# EAGLE design avrdmxsmt (EAGLE 6.5.0)
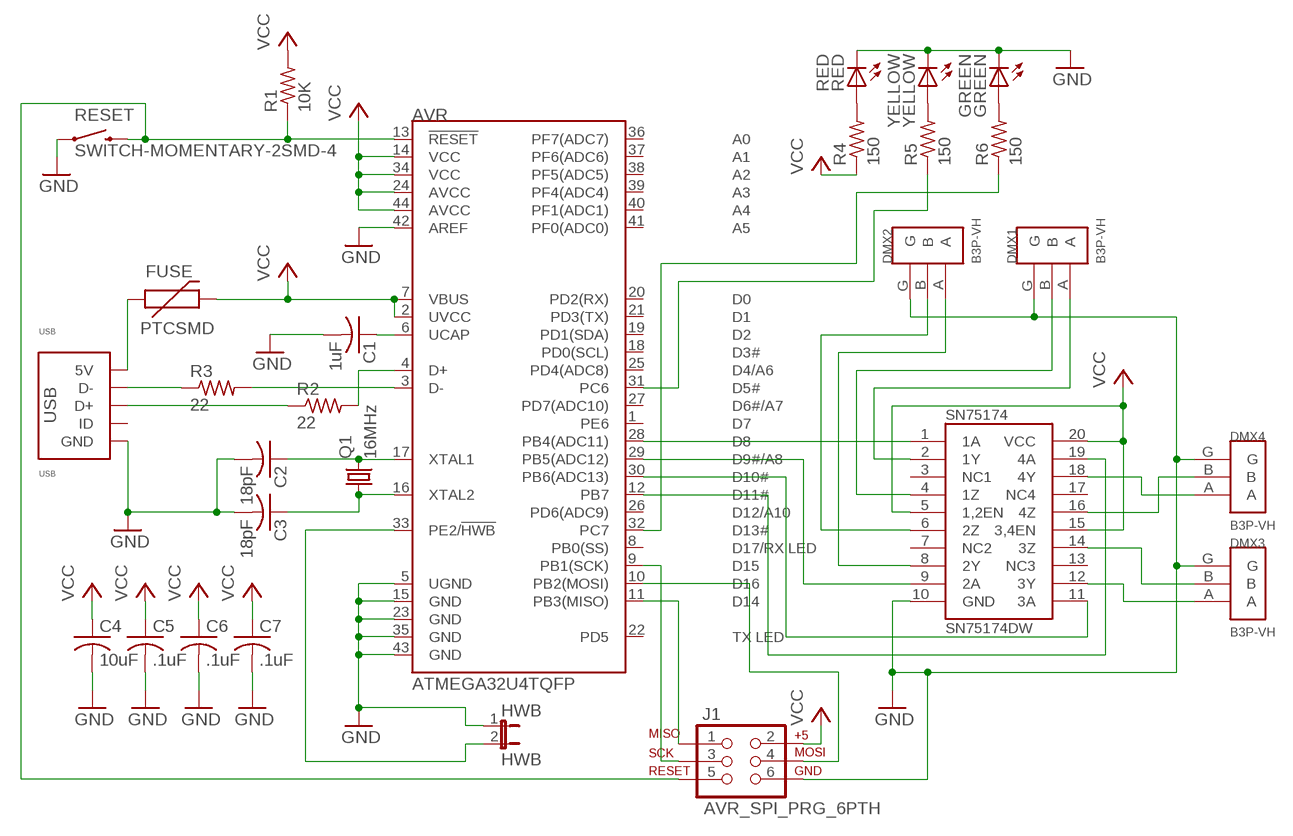
[diagram p0: schematic, sheet 1]

## Parts
AVR  ATMEGA32U4TQFP  [SPARKFUN-DIGITALIC_TQFP44]
C1  1uF  C-USC0603K  [C0603K]
C2  18pF  C-USC0603K  [C0603K]
C3  18pF  C-USC0603K  [C0603K]
C4  10uF  C-USC0603K  [C0603K]
C5  .1uF  C-USC0603K  [C0603K]
C6  .1uF  C-USC0603K  [C0603K]
C7  .1uF  C-USC0603K  [C0603K]
DMX1  B3P-VH  [B3P-VH]
DMX2  B3P-VH  [B3P-VH]
DMX3  B3P-VH  [B3P-VH]
DMX4  B3P-VH  [B3P-VH]
FUSE  PTCSMD  [PTC-1206]
GREEN  GREEN  LED-GREEN0603  [LED-0603]
HWB  HWB  JUMPER-2PTH  [1X02]
J1  AVR_SPI_PRG_6PTH  [2X3]
Q1  16MHz  CRYSTALSM49  [SM49]
R1  10K  R-US_R0603  [R0603]
R2  22  R-US_R0603  [R0603]
R3  22  R-US_R0603  [R0603]
R4  150  R-US_R0603  [R0603]
R5  150  R-US_R0603  [R0603]
R6  150  R-US_R0603  [R0603]
RED  RED  LED-RED0603  [LED-0603]
RESET  SWITCH-MOMENTARY-2SMD-4  [TACTILE_SWITCH_TALL]
SN75174  SN75174DW  [SOIC20R]
USB  USB  USB10118193-0001LF  [10118193-0001LF]
YELLOW  YELLOW  LED-YELLOW0603  [LED-0603]

## Nets
GND: AVR.5(UGND) AVR.15(GND) AVR.23(GND) AVR.35(GND) AVR.42(AREF) AVR.43(GND) C1.2 C2.2 C3.2 C4.2 C5.2 C6.2 C7.2 DMX1.G DMX2.G DMX3.G DMX4.G GREEN.C HWB.1 J1.6 RED.C RESET.A2 SN75174.10(GND) USB.5(GND) USB.S1(GND) USB.S2(GND) USB.S3(GND) USB.S4(GND) YELLOW.C
N$1: AVR.13(!RESET) J1.5 R1.1 RESET.B2
N$2: AVR.3(D-) R3.2
N$3: R3.1 USB.2(D-)
N$4: AVR.4(D+) R2.2
N$5: R2.1 USB.3(D+)
N$6: FUSE.1 USB.1(5V)
N$7: AVR.6(UCAP) C1.1
N$8: AVR.17(XTAL1) C2.1 Q1.2
N$9: AVR.16(XTAL2) C3.1 Q1.1
N$10: AVR.28(PB4(ADC11)) SN75174.1(1A)
N$11: AVR.29(PB5(ADC12)) SN75174.9(2A)
N$12: AVR.30(PB6(ADC13)) SN75174.11(3A)
N$13: AVR.12(PB7) SN75174.19(4A)
N$14: DMX1.A SN75174.2(1Y)
N$15: DMX1.B SN75174.4(1Z)
N$16: DMX2.A SN75174.8(2Y)
N$17: DMX2.B SN75174.6(2Z)
N$18: DMX3.A SN75174.12(3Y)
N$19: DMX3.B SN75174.14(3Z)
N$20: DMX4.A SN75174.18(4Y)
N$21: DMX4.B SN75174.16(4Z)
N$22: R4.2 RED.A
N$23: R5.2 YELLOW.A
N$24: GREEN.A R6.2
N$25: AVR.33(PE2/!HWB) HWB.2
N$26: AVR.32(PC7) R6.1
N$27: AVR.31(PC6) R5.1
N$29: AVR.10(PB2(MOSI)) J1.4
N$30: AVR.11(PB3(MISO)) J1.1
N$31: AVR.9(PB1(SCK)) J1.3
VCC: AVR.2(UVCC) AVR.7(VBUS) AVR.14(VCC) AVR.24(AVCC) AVR.34(VCC) AVR.44(AVCC) C4.1 C5.1 C6.1 C7.1 FUSE.2 J1.2 R1.2 R4.1 SN75174.5(1,2EN) SN75174.15(3,4EN) SN75174.20(VCC)
Unconnected: AVR.1(PE6) AVR.8(PB0(SS)) AVR.18(PD0(SCL)) AVR.19(PD1(SDA)) AVR.20(PD2(RX)) AVR.21(PD3(TX)) AVR.22(PD5) AVR.25(PD4(ADC8)) AVR.26(PD6(ADC9)) AVR.27(PD7(ADC10)) AVR.36(PF7(ADC7)) AVR.37(PF6(ADC6)) AVR.38(PF5(ADC5)) AVR.39(PF4(ADC4)) AVR.40(PF1(ADC1)) AVR.41(PF0(ADC0)) SN75174.3(NC1) SN75174.7(NC2) SN75174.13(NC3) SN75174.17(NC4) USB.4(ID)

## Library data of the parts
AVR = SparkFun-DigitalIC:ATMEGA32U4: Atmel 44-pin 8-bit Microcontroller with 32KBytes of ISP Flash and USB Controller ----- Please use the QFN-44-NOPAD_1:1 package for the footprint of all boards using a 32U4. Route traces directly away from the pads as much as possible.; PROD_ID: IC-11161
C1-C7 = rcl:C-US: CAPACITOR, American symbol
DMX1-DMX4 = avrdmxsmt:B3P-VH
FUSE = SparkFun-PowerIC:PTC: Resettable Fuse PTC Resettable Fuse. Spark Fun Electronics SKU : COM-08357; PROD_ID: RES-11150
GREEN = SparkFun-LED:LED-GREEN: Various green LEDs Green LEDs used in SFE Production 0603- DIO-00821 LARGE- DIO-00862 LILYPAD- DIO-09910; PROD_ID: DIO-00821
HWB = SparkFun-Passives:JUMPER-2: Jumper Basic 0.1" spaced jumper. Use with breakaway headers.
J1 = SparkFun-Connectors:AVR_SPI_PRG_6: AVR ISP 6 Pin This is the reduced ISP connector for AVR programming. Common on Arduino. This footprint will take up less PCB space and can be used with a 10-pin to 6-pin adapter such as SKU: BOB-08508
Q1 = crystal:CRYSTAL: CRYSTAL; OC_FARNELL: unknown; OC_NEWARK: unknown
R1-R6 = rcl:R-US_: RESISTOR, American symbol
RED = SparkFun-LED:LED-RED: Assorted Red LEDs LilyPad 1206- DIO-09912 1206- DIO-00809 0603- DIO-00819; PROD_ID: DIO-00819
RESET = SparkFun-Electromechanical:SWITCH-MOMENTARY-2: Various NO switches- pushbuttons, reed, etc; PROD_ID: SWCH-11966
SN75174 = avrdmxsmt:SN75174DW
USB = PP_Connectors:USB
YELLOW = SparkFun-LED:LED-YELLOW: Yellow SMD LEDs LilyPad 1206- DIO-09909 0603- DIO-09003; PROD_ID: DIO-09003

## Board
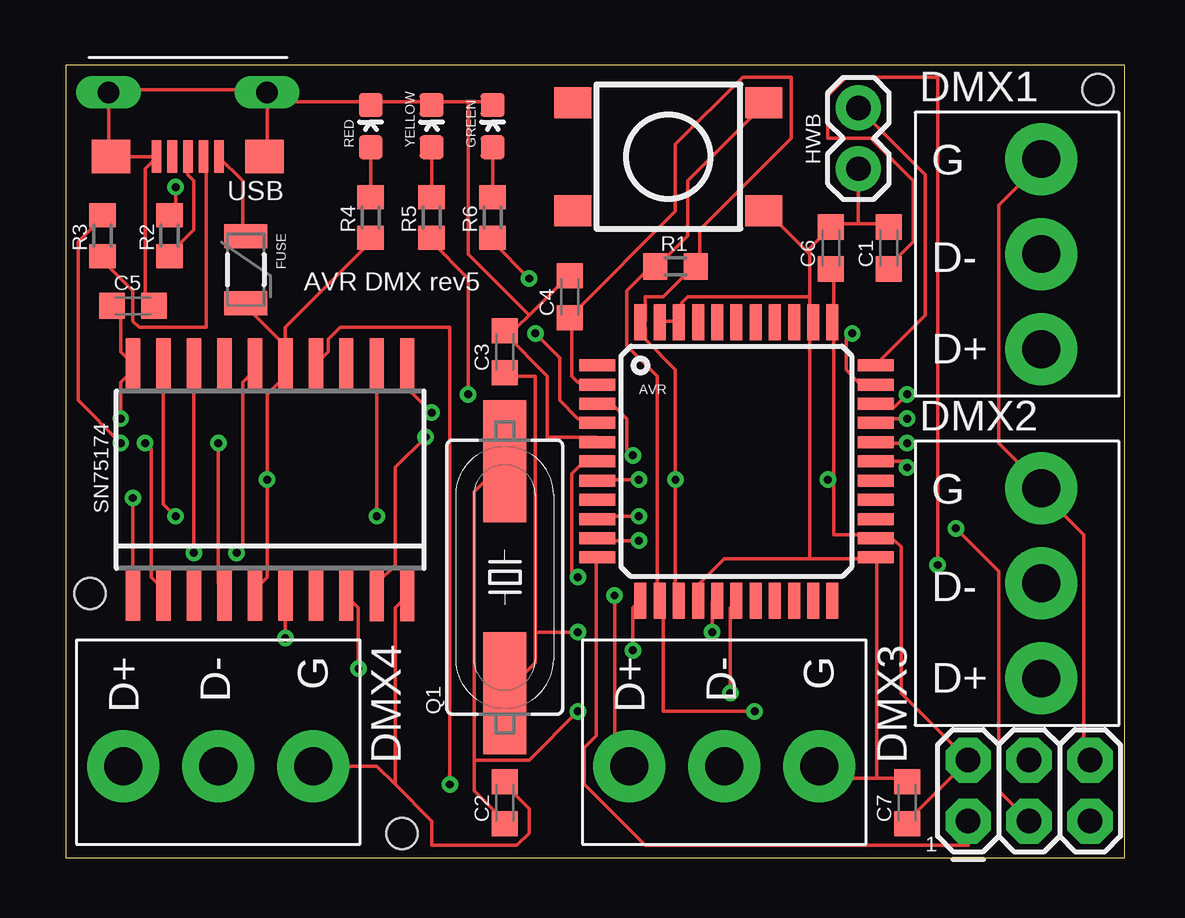
[diagram p1: board, top side]
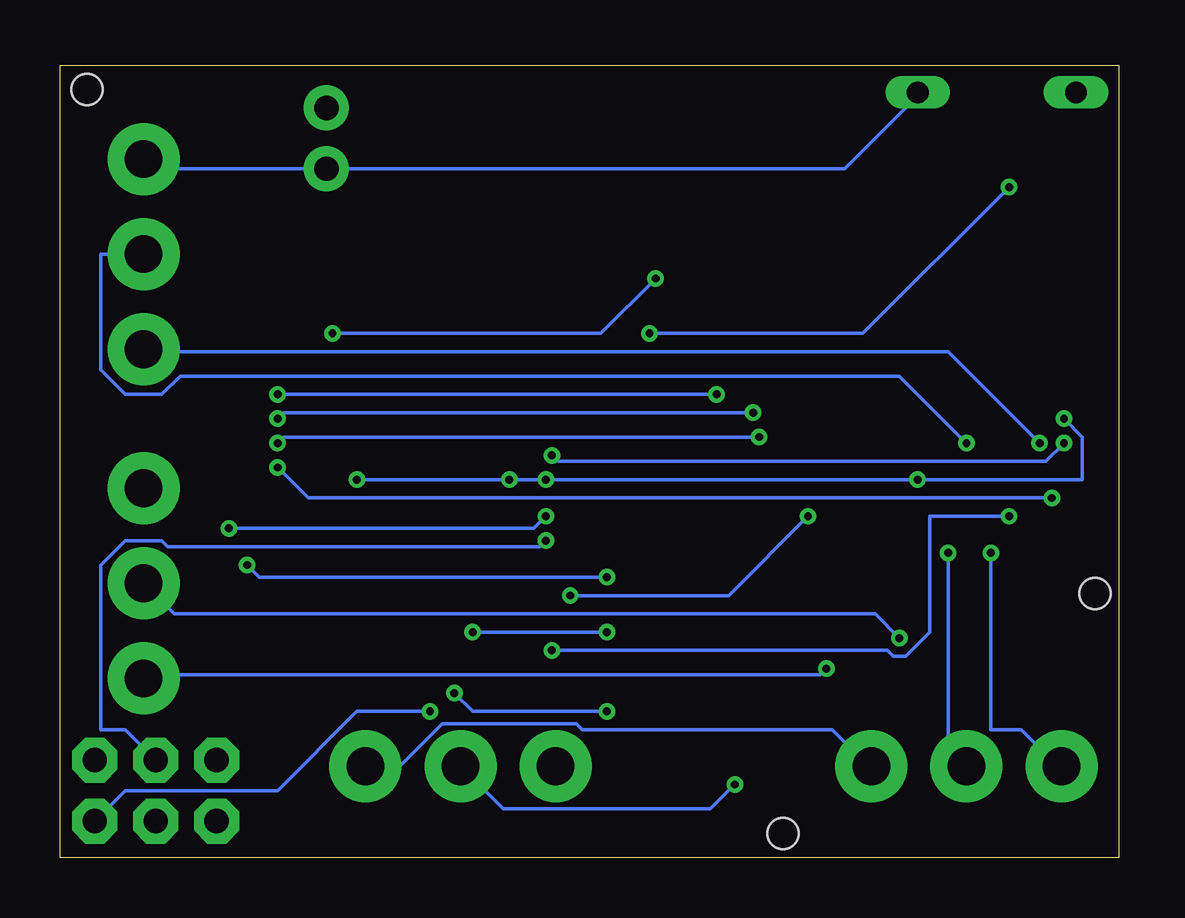
[diagram p2: board, bottom side, seen from below]

Size 44.12 x 33.01 mm. Coordinates in mm from the lower left corner, seen from the top.
Outline: 0,0 44.12,0 44.12,33.01 0,33.01 0,0
Copper layers (1*16): Top 0.0356mm / dielectric 1.5011mm / Bottom 0.0356mm
Design rules "LaenPCBOrder": minimum track width 6mil, minimum drill 13mil, track to track 6mil, track to pad 6mil, pad to pad 6mil, via to via 6mil, smd to smd 6mil, copper to edge 15mil, drill to drill 6mil, minimum pad ring 7mil, minimum via ring 7mil, stop-mask expansion 3mil, vias tented up to drill 0mil, thermal gap 10mil
Holes 1.3 mm at 43,32 1,11 14,1

### Footprints (pad centres in the part's own frame; a part is rotated, then mirrored left to right if it is on the bottom)
SPARKFUN-DIGITALIC_TQFP44 = smd 1.5 x 0.5: 1 -5.8,4; 2 -5.8,3.2; 3 -5.8,2.4; 4 -5.8,1.6; 5 -5.8,0.8; 6 -5.8,0; 7 -5.8,-0.8; 8 -5.8,-1.6; 9 -5.8,-2.4; 10 -5.8,-3.2; 11 -5.8,-4; 23 5.8,-4; 24 5.8,-3.2; 25 5.8,-2.4; 26 5.8,-1.6; 27 5.8,-0.8; 28 5.8,0; 29 5.8,0.8; 30 5.8,1.6; 31 5.8,2.4; 32 5.8,3.2; 33 5.8,4 | smd 0.5 x 1.5: 12 -4,-5.8; 13 -3.2,-5.8; 14 -2.4,-5.8; 15 -1.6,-5.8; 16 -0.8,-5.8; 17 0,-5.8; 18 0.8,-5.8; 19 1.6,-5.8; 20 2.4,-5.8; 21 3.2,-5.8; 22 4,-5.8; 34 4,5.8; 35 3.2,5.8; 36 2.4,5.8; 37 1.6,5.8; 38 0.8,5.8; 39 0,5.8; 40 -0.8,5.8; 41 -1.6,5.8; 42 -2.4,5.8; 43 -3.2,5.8; 44 -4,5.8
C0603K = smd 1.05 x 1.08: 1 -0.875,0; 2 0.875,0
B3P-VH = drill 1.57 pad 3: A 0,-3.96; B 0,0; G 0,3.96
PTC-1206 = smd 1 x 1.8: 1 -1.4,0; 2 1.4,0
LED-0603 = smd 1 x 1: A 0,-0.877; C 0,0.877
1X02 = drill 1.016 pad 1.88: 1 0,0; 2 2.54,0
2X3 = drill 1.016 pad 1.88 octagon: 1 0,0; 2 0,2.54; 3 2.54,0; 4 2.54,2.54; 5 5.08,0; 6 5.08,2.54
SM49 = smd 5.08 x 1.778: 1 -4.826,0; 2 4.826,0
R0603 = smd 1 x 1.1: 1 -0.85,0; 2 0.85,0
TACTILE_SWITCH_TALL = smd 1.55 x 1.3: A1 -3.975,-2.25; A2 3.975,-2.25; B1 -3.975,2.25; B2 3.975,2.25
SOIC20R = smd 0.6 x 2.2: 1 -5.715,-4.775; 2 -4.445,-4.775; 3 -3.175,-4.775; 4 -1.905,-4.775; 5 -0.635,-4.775; 6 0.635,-4.775; 7 1.905,-4.775; 8 3.175,-4.775; 9 4.445,-4.8; 10 5.715,-4.8; 11 5.715,4.8; 12 4.445,4.8; 13 3.175,4.8; 14 1.905,4.8; 15 0.635,4.8; 16 -0.635,4.8; 17 -1.905,4.8; 18 -3.175,4.8; 19 -4.445,4.8; 20 -5.715,4.8
10118193-0001LF = smd 0.4 x 1.35: 1 -1.3,2.54; 2 -0.65,2.54; 3 0,2.54; 4 0.65,2.54; 5 1.3,2.54 | drill 0.9 long: S1 -3.3,-0.135; S2 3.3,-0.135 | smd 1.6 x 1.4: S3 -3.2,2.54; S4 3.2,2.54

### Placement (x,y rotation side)
AVR  27.94,16.51 0 top
C1  34.29,25.4 90 top
C2  18.29,2.29 90 top
C3  18.29,21.08 90 top
C4  21,23.37 90 top
C5  2.79,22.99 0 top
C6  31.88,25.4 90 top
C7  35.05,2.29 90 top
DMX1  40.64,25.15 0 top
DMX2  40.64,11.43 0 top
DMX3  27.43,3.81 270 top
DMX4  6.35,3.81 270 top
FUSE  7.5,24.5 270 top
GREEN  17.78,30.48 0 top
HWB  33.02,28.7 90 top
J1  37.59,1.52 0 top
Q1  18.29,11.68 90 top
R1  25.4,24.64 0 top
R2  4.32,25.91 90 top
R3  1.52,25.91 90 top
R4  12.7,26.67 90 top
R5  15.24,26.67 90 top
R6  17.78,26.67 90 top
RED  12.7,30.48 0 top
RESET  25.1,29.21 0 top
SN75174  8.51,15.75 0 top
USB  5.08,31.75 180 top
YELLOW  15.24,30.48 0 top

### Tracks (layer width: path | path; a pad name or v marks a point on that pad's centre or on a via)
GND
  Top 0.152: C5.2 3.56,23.11 3.3,23.37 3.3,28.7 3.81,29.21 USB.5 USB.S4 1.78,29.21 1.78,31.75 USB.S2 2.03,32 8.13,32 USB.S1 | 19.3,22.61 20.83,24.13 C4.2 | 19.3,22.61 18.8,22.1 18.29,22.1 C3.2 18.29,21.84 20.07,20.07 20.07,17.53 22.1,17.53 AVR.5 | 15.24,31.5 12.7,31.5 | 15.24,31.5 16.76,31.5 | 16.76,31.5 17.78,31.5 GREEN.C | 15.24,31.5 YELLOW.C | 8.38,31.5 8.38,31.75 USB.S1 | 8.38,31.5 8.38,29.21 USB.S3 | 8.38,31.5 12.7,31.5 | 12.7,31.5 RED.C | 8.38,31.5 USB.S1 | 19.3,22.61 16.76,25.15 16.76,31.5 | J1.6 42.42,4.32 42.42,13.46 40.64,15.24 DMX2.G 40.64,15.49 38.86,17.27 38.86,27.18 40.64,28.96 DMX1.G | 13.72,3.05 12.95,3.81 DMX4.G | 13.72,3.05 15.24,1.52 15.24,0.51 18.8,0.51 19.3,1.02 19.3,2.03 18.29,3.05 C2.2 | 13.72,3.05 13.72,10.41 14.22,10.92 SN75174.10 | 30.99,12.45 33.53,12.45 AVR.23 33.78,12.45 33.78,3.3 | 30.99,12.45 27.43,12.45 26.42,11.43 26.42,10.92 AVR.15 | 33.78,3.3 31.5,3.3 31.5,3.81 DMX3.G | 33.78,3.3 35.05,3.3 C7.2 | AVR.43 24.89,22.35 25.4,22.35 AVR.42 25.65,22.35 25.65,23.11 25.91,23.37 30.99,23.37 | 33.02,26.42 34.29,26.42 C1.2 | 33.02,26.42 32,26.42 C6.2 31.75,26.16 30.99,25.4 30.99,25.15 | 30.99,25.15 30.99,23.37 | 30.99,23.37 30.99,22.35 AVR.35 30.99,22.1 30.99,12.45 | 30.99,25.15 29.21,26.92 RESET.A2 | 33.02,26.42 HWB.1
  Bottom 0.152: DMX1.G 40.64,28.96 40.39,28.7 HWB.1 11.43,28.7 8.38,31.75 USB.S1 | DMX3.G 29.97,3.81 28.19,5.59 22.61,5.59 22.35,5.33 11.94,5.33 10.41,3.81 DMX4.G
N$1  (via drill 0.33)
  Top 0.152: RESET.B2 28.96,31.24 25.91,28.19 25.91,25.91 24.64,24.64 R1.1 24.38,24.64 23.37,23.62 23.37,21.34 24.64,20.07 24.64,10.92 AVR.13 24.89,10.67 24.89,6.1 v28.7,6.1
  Bottom 0.152: J1.5 41.4,2.79 35.05,2.79 31.75,6.1 v28.7,6.1
N$2  (via drill 0.33)
  Top 0.152: v2.29,17.27 0.51,19.05 0.51,25.65 1.52,26.67 R3.2 | v23.62,16.76 23.37,17.02 23.37,18.29 22.86,18.8 22.35,18.8 AVR.3
  Bottom 0.152: v2.29,17.27 3.05,16.51 23.37,16.51 v23.62,16.76
N$3
  Top 0.152: R3.1 1.52,24.89 2.79,23.62 2.79,22.35 3.05,22.1 5.84,22.1 5.84,29.21 USB.2
N$4  (via drill 0.33)
  Top 0.152: v4.57,27.94 4.57,27.18 4.32,26.92 R2.2 | v19.56,21.84 20.57,20.83 20.57,19.05 21.34,18.29 22.1,18.29 AVR.4
  Bottom 0.152: v4.57,27.94 10.67,21.84 v19.56,21.84
N$5
  Top 0.152: USB.3 5.08,28.45 5.33,28.19 5.33,26.16 4.32,25.15 R2.1
N$6
  Top 0.152: USB.1 6.35,29.21 7.37,28.19 7.37,25.91 FUSE.1
N$7  (via drill 0.33)
  Top 0.152: v36.32,12.19 36.32,32.51 32.51,32.51 31.75,31.75 31.75,29.97 33.53,29.97 35.31,28.19 35.31,25.65 34.29,24.64 C1.1 | v21.34,11.68 21.08,11.94 21.08,16 21.59,16.51 AVR.6
  Bottom 0.152: v36.32,12.19 35.81,11.68 v21.34,11.68
N$8  (via drill 0.33)
  Top 0.152: 17.02,4.06 17.02,15.24 Q1.2 | 17.02,4.06 17.02,2.79 18.29,1.52 C2.1 | v27.69,6.86 27.69,10.41 27.94,10.67 AVR.17 | v21.34,6.1 19.3,4.06 17.02,4.06
  Bottom 0.152: v27.69,6.86 26.92,6.1 v21.34,6.1
N$9  (via drill 0.33)
  Top 0.152: 19.56,9.4 19.56,8.13 Q1.1 | 19.56,9.4 19.56,20.07 18.29,20.07 C3.1 | v26.92,9.4 26.92,10.67 AVR.16 | 19.56,9.4 v21.34,9.4
  Bottom 0.152: v21.34,9.4 v26.92,9.4
N$10  (via drill 0.33)
  Top 0.152: AVR.28 35.05,16.51 v35.05,16.26 | SN75174.1 v2.79,14.99
  Bottom 0.152: v35.05,16.26 33.78,14.99 v2.79,14.99
N$11  (via drill 0.33)
  Top 0.152: v35.05,17.27 33.78,17.27 AVR.29 | v14.99,17.53 13.72,16.26 13.72,12.19 12.95,11.43 SN75174.9
  Bottom 0.152: v35.05,17.27 34.8,17.53 v14.99,17.53
N$12  (via drill 0.33)
  Top 0.152: v35.05,18.29 33.78,18.29 AVR.30 | v15.24,18.54 14.22,19.56 SN75174.11
  Bottom 0.152: v35.05,18.29 34.8,18.54 v15.24,18.54
N$13  (via drill 0.33)
  Top 0.152: v23.62,8.64 23.62,10.41 23.88,10.67 AVR.12 | v4.57,14.22 4.06,14.73 SN75174.19
  Bottom 0.152: v23.62,8.64 9.65,8.64 9.4,8.38 8.89,8.38 7.87,9.4 7.87,14.22 v4.57,14.22
N$14  (via drill 0.33)
  Top 0.152: v3.3,17.27 3.56,17.02 3.56,11.68 4.06,11.18 SN75174.2
  Bottom 0.152: v3.3,17.27 7.11,21.08 40.64,21.08 DMX1.A
N$15  (via drill 0.33)
  Top 0.152: v6.35,17.27 6.35,11.43 6.6,11.18 SN75174.4
  Bottom 0.152: v6.35,17.27 9.14,20.07 39.12,20.07 39.88,19.3 41.4,19.3 42.42,20.32 42.42,25.15 DMX1.B
N$16  (via drill 0.33)
  Top 0.152: v12.19,7.87 12.19,10.41 11.68,10.92 SN75174.8
  Bottom 0.152: v12.19,7.87 12.45,7.62 40.64,7.62 DMX2.A
N$17  (via drill 0.33)
  Top 0.152: v9.14,9.14 SN75174.6
  Bottom 0.152: v9.14,9.14 10.16,10.16 39.37,10.16 DMX2.B
N$18  (via drill 0.33)
  Top 0.152: v12.95,14.22 SN75174.12 | v22.86,10.92 22.86,4.32 23.37,3.81 DMX3.A
  Bottom 0.152: v12.95,14.22 16.26,10.92 v22.86,10.92
N$19  (via drill 0.33)
  Top 0.152: v16,3.05 16,22.1 11.43,22.1 10.92,21.59 10.92,21.08 10.41,20.57 SN75174.14
  Bottom 0.152: v16,3.05 17.02,2.03 25.65,2.03 DMX3.B
N$20  (via drill 0.33)
  Top 0.152: v5.33,12.7 SN75174.18
  Bottom 0.152: v5.33,12.7 5.33,5.33 4.06,5.33 2.54,3.81 DMX4.A
N$21  (via drill 0.33)
  Top 0.152: v7.11,12.7 7.37,12.95 7.37,19.81 7.87,20.32 SN75174.16
  Bottom 0.152: v7.11,12.7 7.11,3.81 DMX4.B
N$22
  Top 0.152: R4.2 RED.A
N$23
  Top 0.152: R5.2 YELLOW.A
N$24
  Top 0.152: R6.2 GREEN.A
N$25
  Top 0.152: HWB.2 35.81,28.45 35.81,22.61 33.78,20.57 AVR.33
N$26  (via drill 0.33)
  Top 0.152: v19.3,24.13 17.78,25.65 R6.1 | v32.77,21.84 32.51,21.59 32.51,20.32 33.02,19.81 33.53,19.81 AVR.32
  Bottom 0.152: v19.3,24.13 21.59,21.84 v32.77,21.84
N$27  (via drill 0.33)
  Top 0.152: v16.76,19.3 16.76,24.13 15.24,25.65 R5.1 | v35.05,19.3 34.54,18.8 33.78,18.8 AVR.31
  Bottom 0.152: v35.05,19.3 v16.76,19.3
N$29  (via drill 0.33)
  Top 0.152: v23.88,13.21 22.35,13.21 AVR.10
  Bottom 0.152: v23.88,13.21 24.13,12.95 39.62,12.95 39.88,13.21 41.4,13.21 42.42,12.19 42.42,5.33 41.4,5.33 J1.4
N$30
  Top 0.152: J1.1 37.59,0.51 24.13,0.51 21.59,3.05 21.59,4.57 22.1,5.08 22.1,12.45 AVR.11
N$31  (via drill 0.33)
  Top 0.152: v23.88,14.22 22.35,14.22 AVR.9 | v37.08,13.72 38.86,11.94 38.86,2.79 J1.3
  Bottom 0.152: v23.88,14.22 24.38,13.72 v37.08,13.72
VCC  (via drill 0.33)
  Top 0.152: C7.1 35.05,1.52 J1.2 34.8,6.86 34.8,12.95 34.54,13.21 33.78,13.21 AVR.24 33.53,13.46 32,13.46 32,15.75 | C6.1 32,24.38 32,22.35 AVR.34 32,22.1 32,15.75 | SN75174.15 9.14,21.34 | 9.14,21.34 9.14,22.1 12.7,25.65 R4.1 | 9.14,21.34 7.62,22.86 FUSE.2 | 9.14,20.57 SN75174.15 | SN75174.15 9.14,20.07 8.38,19.3 v8.38,15.75 8.38,11.68 7.87,11.18 SN75174.5 | C5.1 2.03,22.86 2.29,22.61 2.29,21.08 2.79,20.57 SN75174.20 2.79,20.32 2.29,19.81 v2.29,18.29 | AVR.2 22.1,19.81 21.34,19.81 21.08,20.07 21.08,22.35 C4.1 21.08,22.61 25.4,26.92 25.4,29.72 28.19,32.51 30.23,32.51 30.23,29.97 26.42,26.16 26.42,24.64 R1.2 26.16,24.64 24.89,23.37 24.13,23.37 24.13,22.35 AVR.44 24.13,22.1 24.13,21.59 25.4,20.32 v25.4,15.75 25.4,10.92 AVR.14 | v23.88,15.75 22.35,15.75 AVR.7 | v31.75,15.75 32,15.75
  Bottom 0.152: v2.29,18.29 1.52,17.53 1.52,15.75 v8.38,15.75 v23.88,15.75 v25.4,15.75 v31.75,15.75

### Text on the board
tNames: AVR DMX rev5 | 1